# Altium schematic sheet DDC_INTEGRATOR.SchDoc
size A4; SheetNumber: 8; SheetTotal: 11
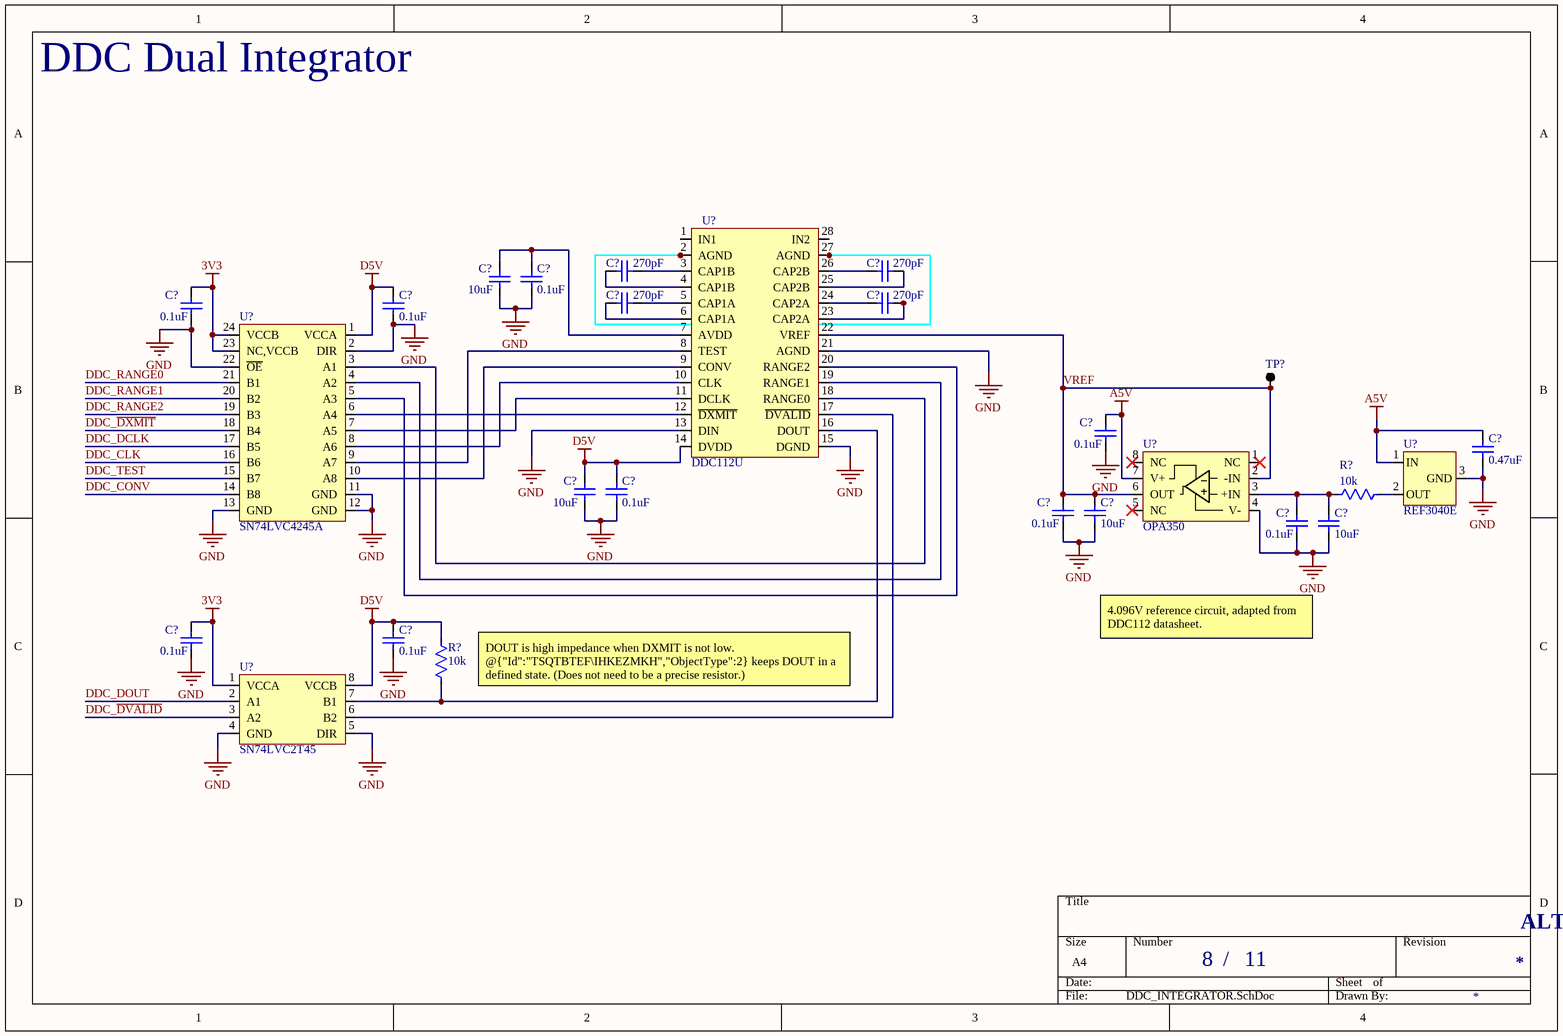
[diagram p0: DDC_INTEGRATOR.SchDoc]

## Parts
(Parts that share a designator on the sheet are numbered #1, #2 ... from top to bottom, then left to right.)
C?#1  10uF  [CAP 0805 IPC MID DENSITY]
C?#2  0.1uF  [CAP 0603 IPC MID DENSITY]
C?#3  270pF  [CAP 1206 NON-IPC CUSTOM]
C?#4  270pF  [CAP 1206 NON-IPC CUSTOM]
C?#5  0.1uF  [CAP 0603 IPC MID DENSITY]
C?#6  0.1uF  [CAP 0603 IPC MID DENSITY]
C?#7  270pF  [CAP 1206 NON-IPC CUSTOM]
C?#8  270pF  [CAP 1206 NON-IPC CUSTOM]
C?#9  0.47uF  [CAP 0603 IPC MID DENSITY]
C?#10  0.1uF  [CAP 0603 IPC MID DENSITY]
C?#11  10uF  [CAP 0805 IPC MID DENSITY]
C?#12  0.1uF  [CAP 0603 IPC MID DENSITY]
C?#13  0.1uF  [CAP 0603 IPC MID DENSITY]
C?#14  10uF  [CAP 0805 IPC MID DENSITY]
C?#15  0.1uF  [CAP 0603 IPC MID DENSITY]
C?#16  10uF  [CAP 0805 IPC MID DENSITY]
C?#17  0.1uF  [CAP 0603 IPC MID DENSITY]
C?#18  0.1uF  [CAP 0603 IPC MID DENSITY]
R?#1  10k  [RES 0603 IPC MID DENSITY]
R?#2  10k  [RES 0603 IPC MID DENSITY]
TP?  Testpoint  [TESTPOINT THT]  (value not drawn)  (no BOM)
U?#1  DDC112U  [28SOIC LOW DENSITY TI]
U?#2  SN74LVC4245A  [24TSSOP LOW DENSITY TI]
U?#3  REF3040E  [SOT23-3 MID DENSITY TI]
U?#4  OPA350  [8VSSOP LOW DENSITY TI]
U?#5  SN74LVC2T45  [8VSSOP LOW DENSITY TI]

## Nets
3V3: C?#5.1 C?#17.1 U?#2.23(NC,VCCB) U?#2.24(VCCB) U?#5.1(VCCA)
A5V: C?#9.1 C?#10.2 U?#3.1(IN) U?#4.7(V+)
D5V: C?#6.1 C?#11.1 C?#12.1 C?#18.1 R?#2.2 U?#1.14(DVDD) U?#2.1(VCCA) U?#5.8(VCCB)
GND: C?#1.2 C?#2.2 C?#5.2 C?#6.2 C?#9.2 C?#10.1 C?#11.2 C?#12.2 C?#13.2 C?#14.2 C?#15.2 C?#16.2 C?#17.2 C?#18.2 U?#1.13(DIN) U?#1.15(DGND) U?#1.21(AGND) U?#2.2(DIR) U?#2.11(GND) U?#2.12(GND) U?#2.13(GND) U?#2.22(~{OE}) U?#3.3(GND) U?#4.4(V-) U?#5.4(GND) U?#5.5(DIR)
DDC_CLK: U?#2.16(B6)
DDC_CONV: U?#2.14(B8)
DDC_~{DVALID}: U?#5.3(A2)
DDC_~{DXMIT}: U?#2.18(B4)
DDC_DCLK: U?#2.17(B5)
DDC_DOUT: U?#5.2(A1)
DDC_RANGE0: U?#2.21(B1)
DDC_RANGE1: U?#2.20(B2)
DDC_RANGE2: U?#2.19(B3)
DDC_TEST: U?#2.15(B7)
VREF: C?#13.1 C?#14.1 TP?.1 U?#1.22(VREF) U?#4.2(-IN) U?#4.6(OUT)
NetC?#1_1: C?#1.1 C?#2.1 U?#1.7(AVDD)
NetC?#3_1: C?#3.1 U?#1.4(CAP1B)
NetC?#3_2: C?#3.2 U?#1.3(CAP1B)
NetC?#4_1: C?#4.1 U?#1.25(CAP2B)
NetC?#4_2: C?#4.2 U?#1.26(CAP2B)
NetC?#7_1: C?#7.1 U?#1.5(CAP1A)
NetC?#7_2: C?#7.2 U?#1.6(CAP1A)
NetC?#8_1: C?#8.1 U?#1.24(CAP2A)
NetC?#8_2: C?#8.2 U?#1.23(CAP2A)
NetC?#15_1: C?#15.1 C?#16.1 R?#1.1 U?#4.3(+IN)
NetR?#1_2: R?#1.2 U?#3.2(OUT)
NetR?#2_1: R?#2.1 U?#1.16(DOUT) U?#5.7(B1)
NetU?#1_8: U?#1.8(TEST) U?#2.9(A7)
NetU?#1_9: U?#1.9(CONV) U?#2.10(A8)
NetU?#1_10: U?#1.10(CLK) U?#2.8(A6)
NetU?#1_11: U?#1.11(DCLK) U?#2.7(A5)
NetU?#1_12: U?#1.12(~{DXMIT}) U?#2.6(A4)
NetU?#1_17: U?#1.17(~{DVALID}) U?#5.6(B2)
NetU?#1_18: U?#1.18(RANGE0) U?#2.3(A1)
NetU?#1_19: U?#1.19(RANGE1) U?#2.4(A2)
NetU?#1_20: U?#1.20(RANGE2) U?#2.5(A3)

Not connected (* = marked no-connect by the designer): U?#1 1(IN1) 2(AGND) 27(AGND) 28(IN2); U?#4 1(NC)* 5(NC)* 8(NC)*

## Notes on the sheet
- DDC Dual Integrator
- 4.096V reference circuit, adapted from DDC112 datasheet.
- (near R?#2) DOUT is high impedance when DXMIT is not low. @{"Id":"TSQTBTEF\IHKEZMKH","ObjectType":2} keeps DOUT in a defined state. (Does not need to be a precise resistor.)
- /
- ALTAIR PhotoDiode ReadOut (PDRO) - Squad

## Library data of the parts
C?#1 C?#11 C?#14 C?#16 = CAP: Murata GRM21BR61E106KA73L - Cap Ceramic 10uF 10% 25V X5R 0805; MF: Murata; MP: GRM21BR61E106KA73L
C?#2 C?#5 C?#6 C?#10 C?#12 C?#13 C?#15 C?#17 C?#18 = CAP: Kemet C0603C104K5RACAUTO - Cap Ceramic 0.1uF 50V X7R 10% 0603 125C Paper T/R; MF: KEMET; MP: C0603C104K5RACAUTO
C?#3 C?#4 C?#7 C?#8 = CAP: Yageo CC1206FRNPO9BN271 - Cap Ceramic 270pF 1% C0G/NP0 50V SMD 1206; MF: YAGEO; MP: CC1206FRNPO9BN271
C?#9 = CAP: Murata GRM188R71E474KA12D - Cap Ceramic 0.47uF 25V X7R 10% 0603 125C; MF: Murata; MP: GRM188R71E474KA12D
R?#1 R?#2 = RES: Res, Any, Manually select footprint; MF: Panasonic Industry; MP: ERJ-3AEB103V
U?#1 = DDC112U: Dual Current Input 20-Bit ADC 28SOIC; MF: Texas Instruments; MP: DDC112U
U?#2 = SN74LVC4245A: Octal Bus Transceiver and 3.3V to 5V Shifter with Tri-State Outputs 24TSSOP; MF: Texas Instruments; MP: SN74LVC4245APWR
U?#3 = REF3040EAIDBZR: Low-Drift Low-Power Series Voltage Reference 4.096V SOT23-3; MF: Texas Instruments; MP: REF3040EAIDBZR
U?#4 = OPA350EA: High-Speed Single-Supply Rail-to-Rail Op Amp, MicroAmplifier Series, 8VSSOP; MF: Texas Instruments; MP: OPA350EA/2K5
U?#5 = SN74LVC2T45: Dual-Bit Dual-Supply Bus Transceiver With Configurable Voltage Translation 8VSSOP; MF: Texas Instruments; MP: SN74LVC2T45DCUR